# EAGLE design shinobi_3v_3V3_dcdc_jack (EAGLE 8.2.2)
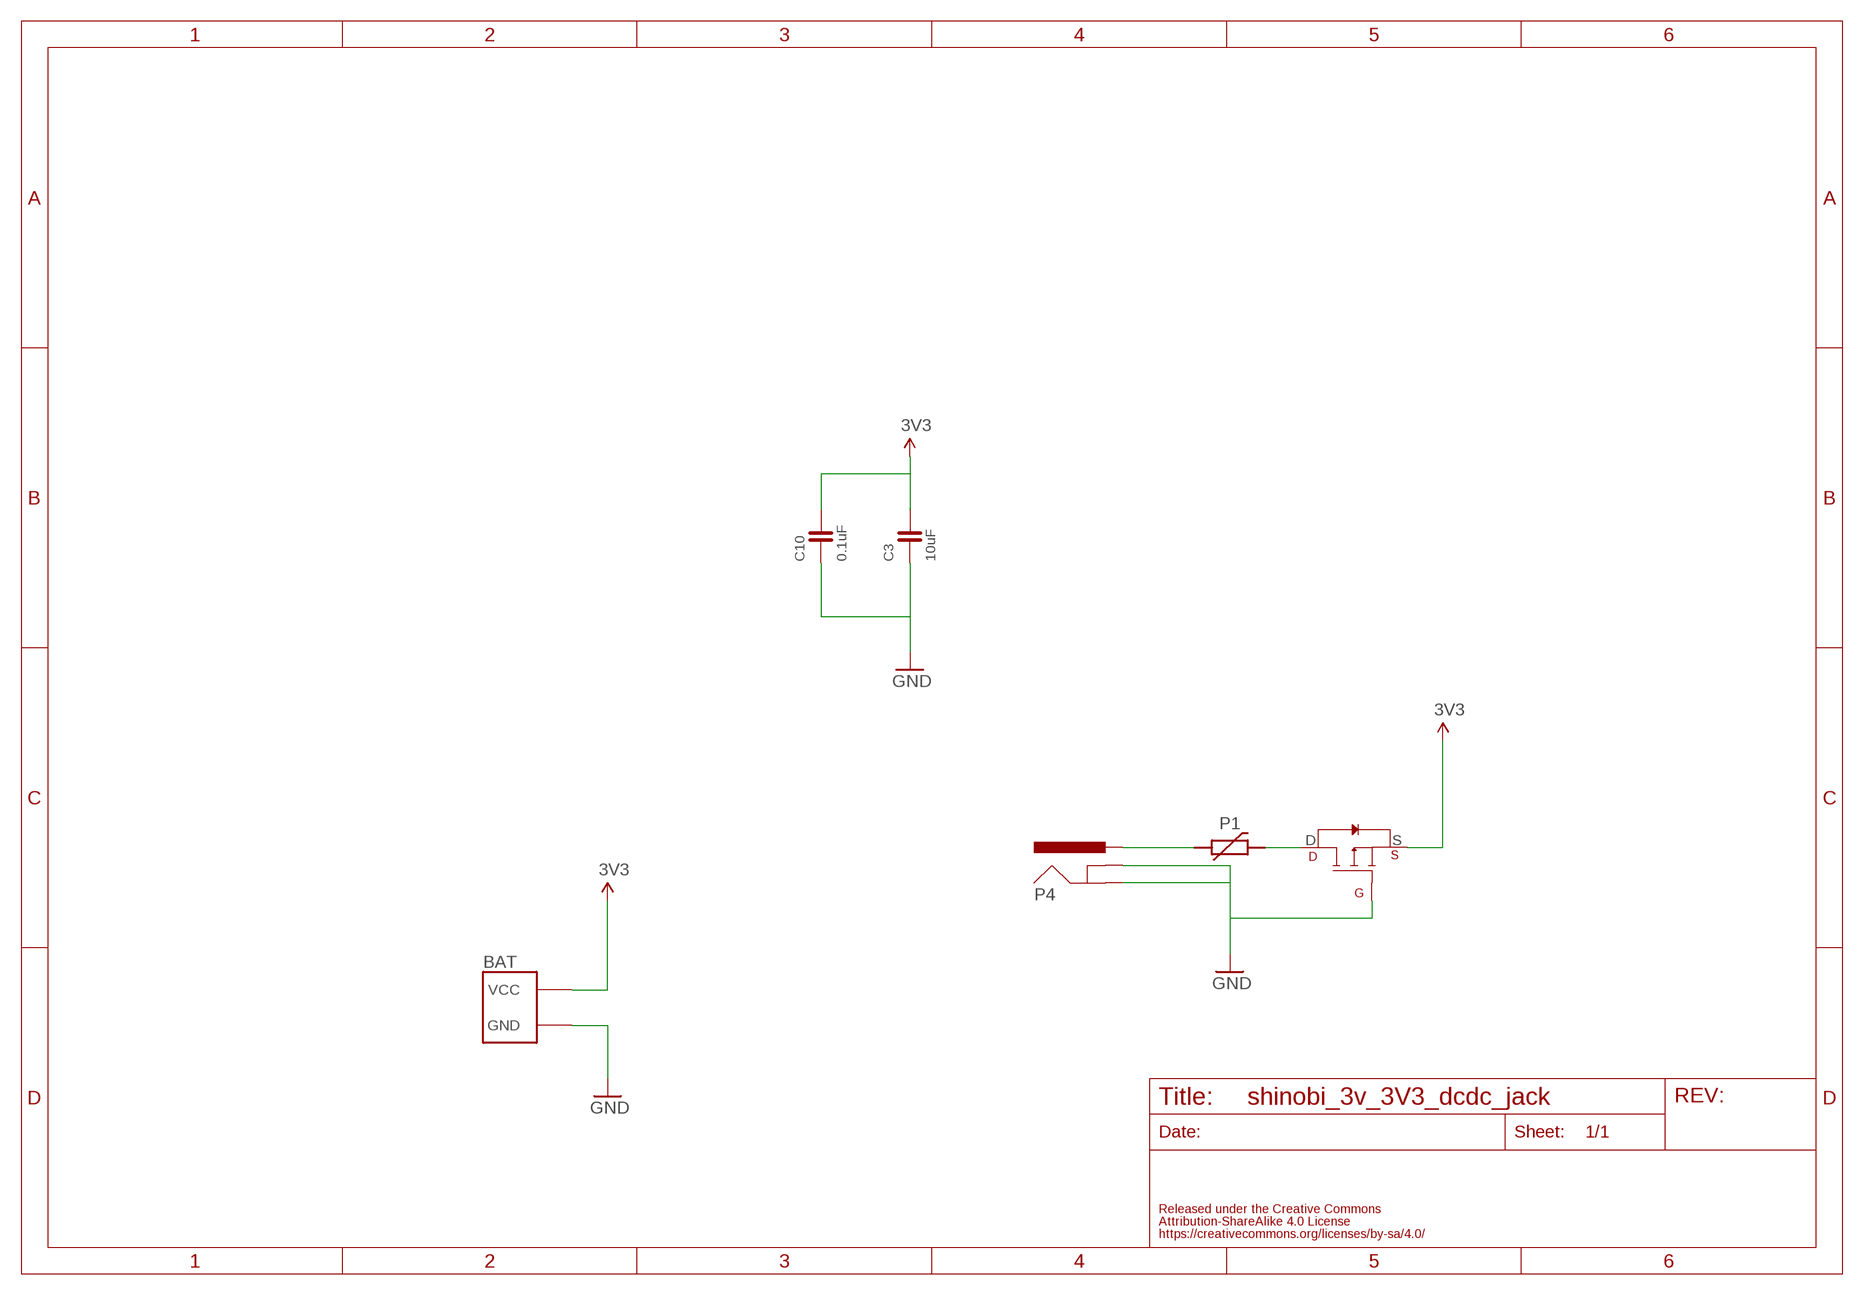
[diagram p0: schematic, sheet 1]

## Parts
BAT  FABO_BRICK_2PIN_SIDE  [FABO_BRICK_2PIN_S02B−PASK-2_SILK]
C3  10uF  CAPACITOR-0603  [0603]
C10  0.1uF  CAPACITOR-0603  [0603]
M1  AOD417  [AOD417]
P1  POLYSWITCH1210  [1210]
P4  DC-JACKMA04339A0  [M04339A0]

## Nets
3V3: BAT.VCC C3.2 C10.2 M1.S
GND: BAT.GND C3.1 C10.1 M1.G P4.GND@2(GND) P4.GND@3(GNDBREAK)
N$3: P1.P$1 P4.VCC(PWR)
N$15: M1.D P1.P$2

## Library data of the parts
BAT = FaBo-Template:FABO_BRICK_2PIN
C3 C10 = FaBo-Capacitor:CAPACITOR: CAPACITOR
M1 = FaBo-Transistor:AOD417
P1 = FaBo-Supply:POLYSWITCH
P4 = FaBo-Supply:DC-JACK

## Board
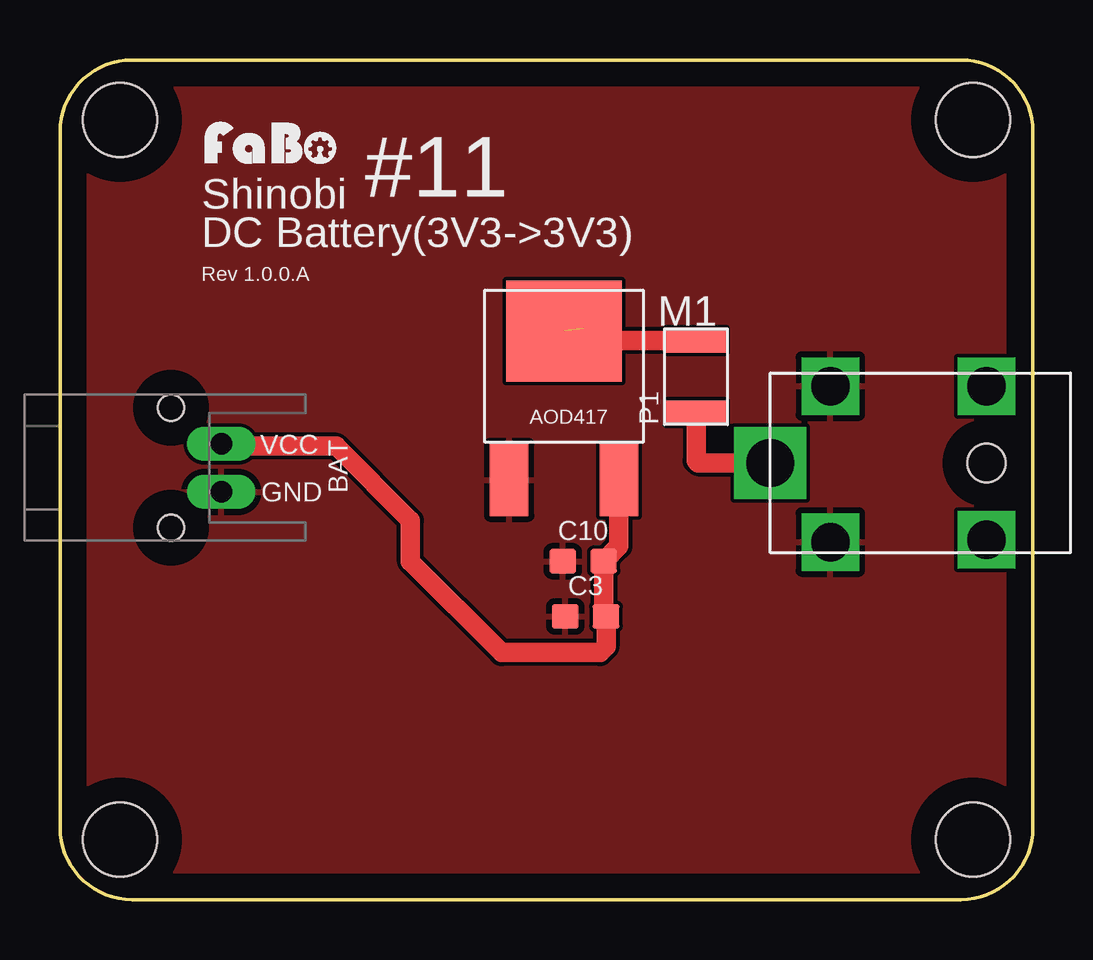
[diagram p1: board, top side]
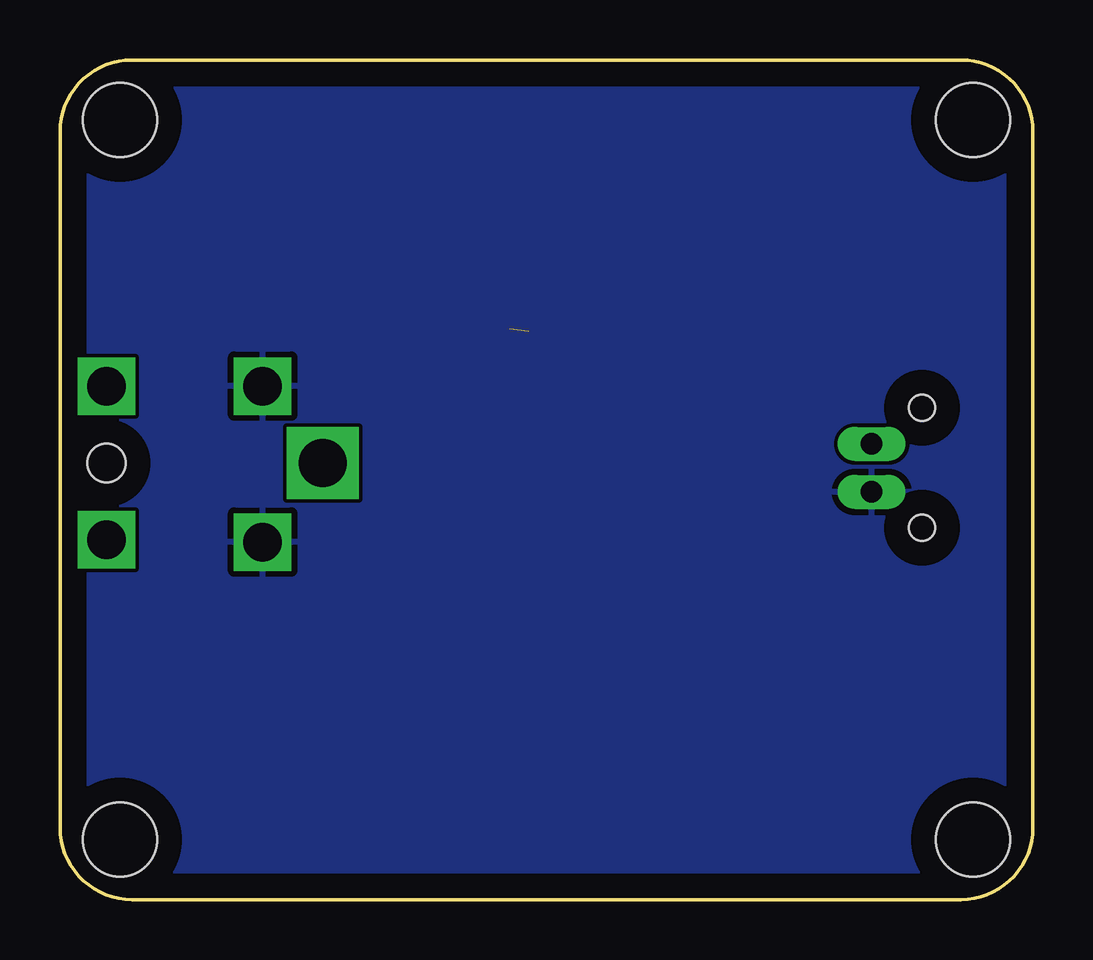
[diagram p2: board, bottom side, seen from below]

Size 40.54 x 35 mm. Coordinates in mm from the lower left corner, seen from the top.
Copper layers (1*16): Top 0.035mm / dielectric 1.5mm / Bottom 0.035mm
Design rules "default": minimum track width 6mil, minimum drill 0.35mm, track to track 6mil, track to pad 6mil, pad to pad 6mil, via to via 6mil, smd to smd 6mil, copper to edge 40mil, drill to drill 6mil, minimum pad ring 10mil, minimum via ring 8mil, stop-mask expansion 4mil, vias tented up to drill 0mil, thermal gap 10mil

### Footprints (pad centres in the part's own frame; a part is rotated, then mirrored left to right if it is on the bottom)
FABO_BRICK_2PIN_S02B−PASK-2_SILK = drill 0.9 pad 1.422 long: GND -1,-0.102; VCC 1,-0.102 | hole 1.1: 2.5,1.998; -2.5,1.998
0603 = smd 1.1 x 1: 1 -0.85,0; 2 0.85,0
AOD417 = smd 4.82 x 4.2: D 0,2.1 | smd 1.6 x 3: G -2.286,-4.1; S 2.286,-4.1
1210 = smd 1 x 2.5: P$1 -1.5,0; P$2 1.5,0
M04339A0 = drill 1.6 square: GND@2 -3.2,-6.5; GND@3 3.3,-6.5; P$1 3.2,0; P$2 -3.2,0 | drill 2 square: VCC 0,-9 | hole 1.6: 0,0
FABO-SHINOBI = hole 3.1: 2.5,32.5; 38.04,32.5; 38.04,2.5; 2.5,2.5

### Placement (x,y rotation side)
BAT  6.62,18 90 top
C3  21.9,11.8 0 top
C10  21.8,14.1 0 top
M1  21,21.6 0 top
P1  26.5,21.8 90 top
P4  38.6,18.2 270 top
U$2  [LOGO_FABO_S]  8.83,30.52 0 top
U$3  [FABO-SHINOBI]  0,0 0 top

### Tracks (layer width: path | path; a pad name or v marks a point on that pad's centre or on a via)
3V3
  Top 0.813: M1.S 23.29,14.74 C10.2 22.65,11.9 C3.2 22.75,10.55 22.5,10.3 18.4,10.3 14.6,14.1 14.6,15.8 11.5,18.9 6.82,18.9 BAT.VCC
GND
  pour Bottom: 0,0 41,0 41,35 0,35
  pour Top: 0,0 41,0 41,35 0,35
N$3
  Top 0.813: P4.VCC 26.6,18.2 26.5,18.3 P1.P$1
N$15  (1 unrouted)
  Top 0.813: 21.1,23.7 M1.D | P1.P$2 22.3,23.3 21.8,23.8

### Text on the board
tPlace: Shinobi | #11 | DC Battery(3V3->3V3) | Rev 1.0.0.A